# EAGLE design lab4_v1 (EAGLE 6.5.0)
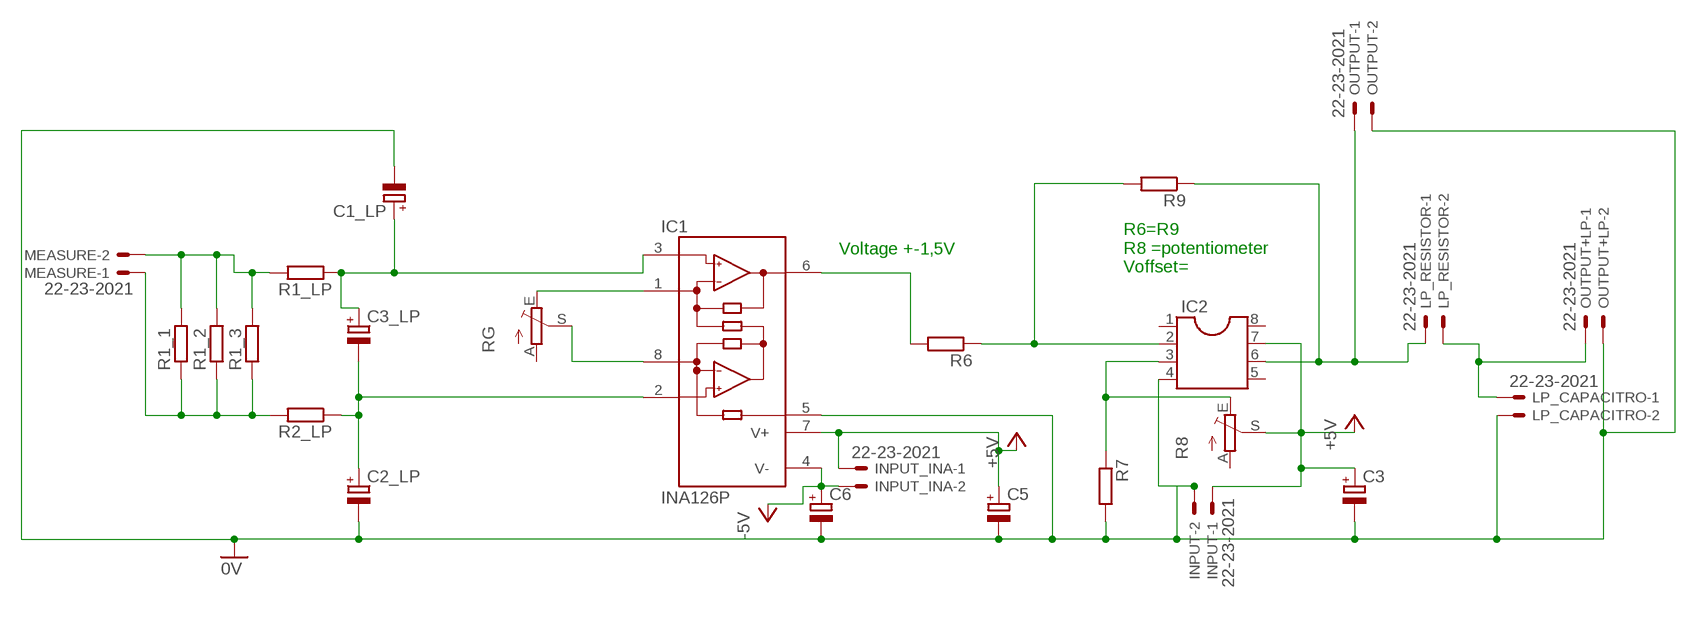
[diagram p0: schematic, sheet 1]

## Parts
C1_LP  CPOL-EUE5-10.5  [E5-10,5]
C2_LP  CPOL-EUE5-10.5  [E5-10,5]
C3  CPOL-EUE5-10.5  [E5-10,5]
C3_LP  CPOL-EUE5-10.5  [E5-10,5]
C5  CPOL-EUE5-10.5  [E5-10,5]
C6  CPOL-EUE5-10.5  [E5-10,5]
IC1  INA126P  [DIL08]
IC2  DIL8  [DIL08]
INPUT  22-23-2021  [22-23-2021]
INPUT_INA  22-23-2021  [22-23-2021]
LP_CAPACITRO  22-23-2021  [22-23-2021]
LP_RESISTOR  22-23-2021  [22-23-2021]
MEASURE  22-23-2021  [22-23-2021]
OUTPUT  22-23-2021  [22-23-2021]
OUTPUT+LP  22-23-2021  [22-23-2021]
R1_1  R-EU_0617/22  [0617/22]
R1_2  R-EU_0617/22  [0617/22]
R1_3  R-EU_0617/22  [0617/22]
R1_LP  R-EU_0207/7  [0207/7]
R2_LP  R-EU_0207/7  [0207/7]
R6  R-EU_0207/7  [0207/7]
R7  R-EU_0207/7  [0207/7]
R8  TRIM_EU-B25P  [B25P]
R9  R-EU_0207/7  [0207/7]
RG  TRIM_EU-B25P  [B25P]

## Nets
+5V_1: C3.+ C5.+ IC1.7(V+) IC2.7 INPUT.1 INPUT_INA.1 R8.S ; supply symbol labelled +5V
-5V: C6.+ IC1.4(V-) INPUT_INA.2
GND: C1_LP.- C2_LP.- C3.- C5.- C6.- IC1.5(REF) IC2.4 INPUT.2 LP_CAPACITRO.2 OUTPUT+LP.2 OUTPUT.2 R7.2 ; supply symbol labelled 0V
N$1: C1_LP.+ C3_LP.+ IC1.3(+IN) R1_LP.1
N$2: C2_LP.+ C3_LP.- IC1.2(-IN) R2_LP.1
N$3: IC1.8(RG) RG.S
N$4: IC1.1(RG) RG.E
N$5: IC1.6(OUT) R6.2
N$6: IC2.2 R6.1 R9.2
N$7: IC2.3 R7.1 R8.E
N$8: MEASURE.1 R1_1.1 R1_2.1 R1_3.1 R2_LP.2
N$9: MEASURE.2 R1_1.2 R1_2.2 R1_3.2 R1_LP.2
N$10: IC2.6 LP_RESISTOR.1 OUTPUT.1 R9.1
N$11: LP_CAPACITRO.1 LP_RESISTOR.2 OUTPUT+LP.1
Unconnected: IC2.1 IC2.5 IC2.8 R8.A RG.A

## Notes on the sheet
- Voltage +-1,5V
- R6=R9
  R8 =potentiometer
  Voffset=

## Library data of the parts
C1_LP C2_LP C3 C3_LP C5 C6 = resistor:CPOL-EU: POLARIZED CAPACITOR, European symbol
IC1 = burr-brown:INA126: Instrumentation Amplifier Micropower, Single and Dual Versions; MF: TEXAS INSTRUMENT CONNECTORS; MPN: INA126P; OC_FARNELL: 1509595; OC_NEWARK: 74C9780
IC2 = ic-package:DIL8: Dual In Line / Socket
INPUT INPUT_INA LP_CAPACITRO LP_RESISTOR MEASURE OUTPUT OUTPUT+LP = con-molex:22-23-2021: .100" (2.54mm) Center Header - 2 Pin; MF: MOLEX; MPN: 22-23-2021; OC_FARNELL: 1462926; OC_NEWARK: 25C3832
R1_1-R1_3 R1_LP R2_LP R6 R7 R9 = resistor:R-EU_: RESISTOR, European symbol
R8 RG = pot:TRIM_EU-: POTENTIOMETER

## Board
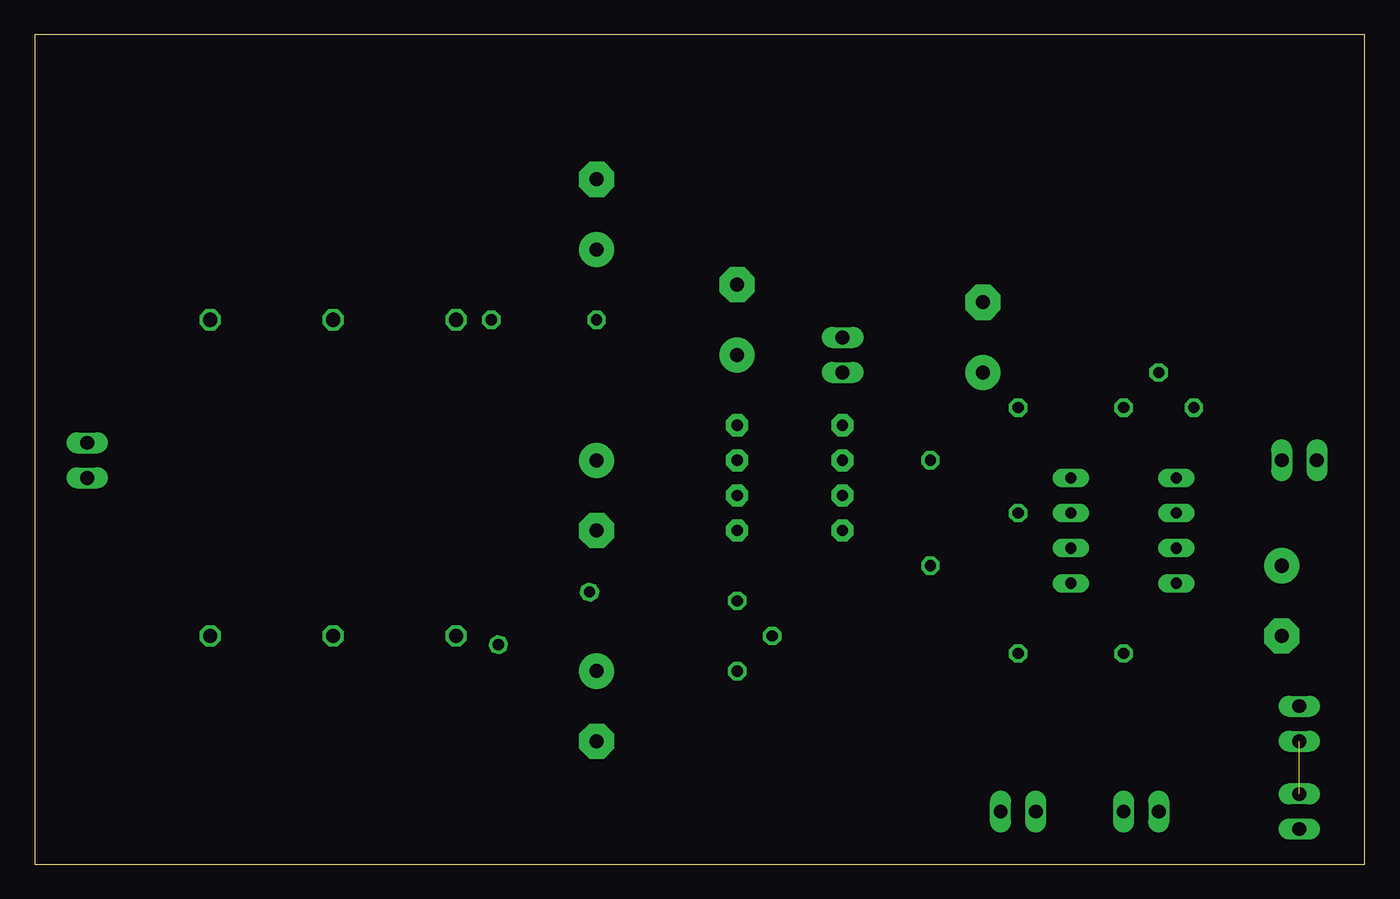
[diagram p1: board, top side]
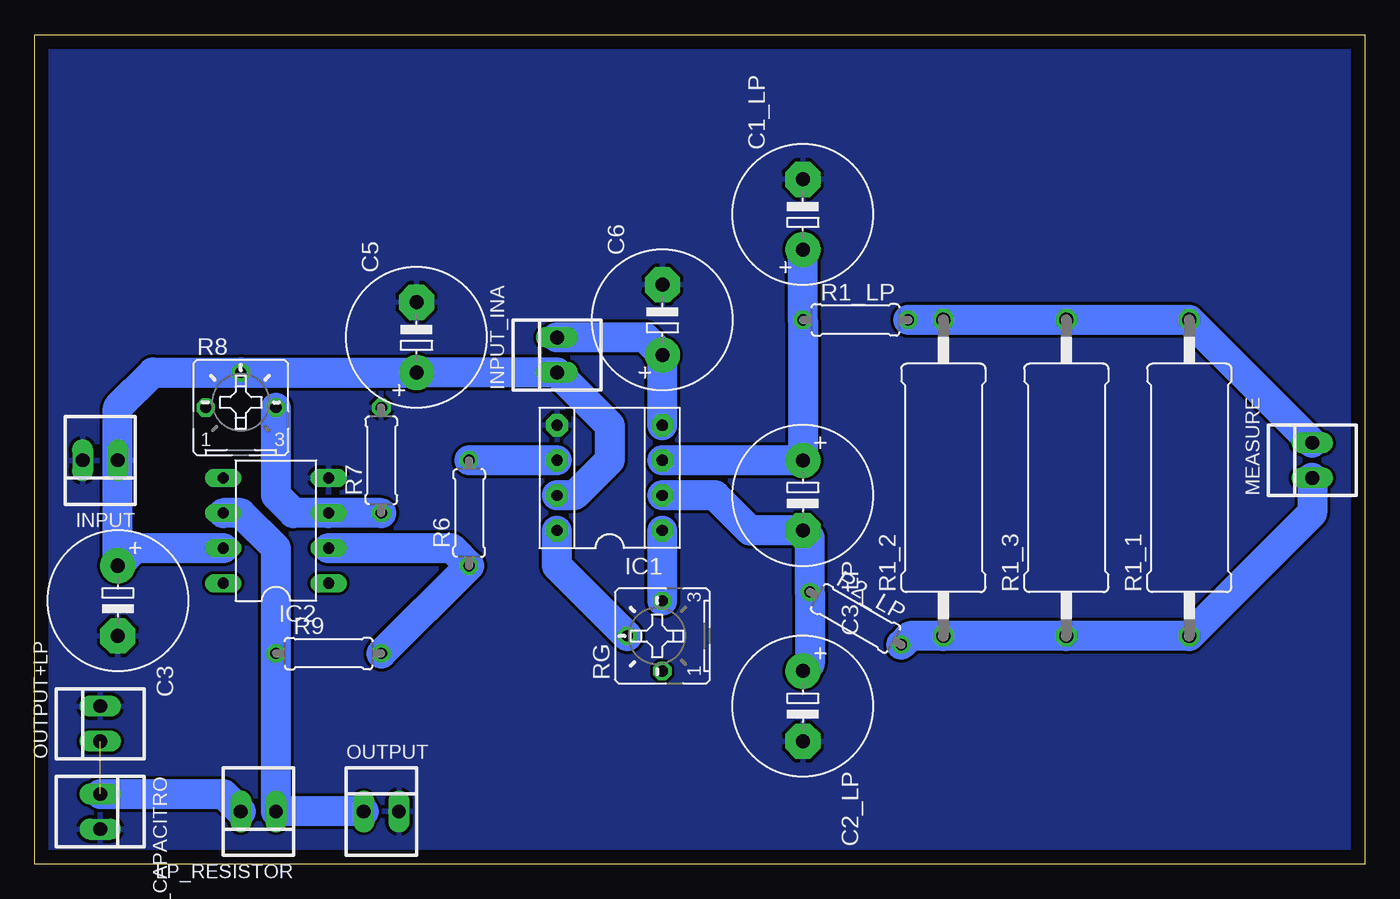
[diagram p2: board, bottom side, seen from below]

Size 96.19 x 60 mm. Coordinates in mm from the lower left corner, seen from the top.
Outline: 0,0 96.19,0 96.19,60 0,60 0,0
Copper layers (1*16): Top 0.035mm / dielectric 1.5mm / Bottom 0.035mm
Design rules "default": minimum track width 10mil, minimum drill 24mil, track to track 8mil, track to pad 8mil, pad to pad 8mil, via to via 8mil, smd to smd 8mil, copper to edge 40mil, drill to drill 8mil, minimum pad ring 10mil, minimum via ring 8mil, stop-mask expansion 4mil, vias tented up to drill 0mil, thermal gap 10mil

### Footprints (pad centres in the part's own frame; a part is rotated, then mirrored left to right if it is on the bottom)
E5-10,5 = drill 1.016 pad 2.54: + -2.54,0 | drill 1.016 pad 2.54 octagon: - 2.54,0
DIL08 = drill 0.813 pad 1.6 octagon: 1 -3.81,-3.81; 2 -1.27,-3.81; 3 1.27,-3.81; 4 3.81,-3.81; 5 3.81,3.81; 6 1.27,3.81; 7 -1.27,3.81; 8 -3.81,3.81
DIL08' = drill 0.813 long: 1 -3.81,-3.81; 2 -1.27,-3.81; 3 1.27,-3.81; 4 3.81,-3.81; 5 3.81,3.81; 6 1.27,3.81; 7 -1.27,3.81; 8 -3.81,3.81
22-23-2021 = drill 1 long: 1 -1.27,0; 2 1.27,0
0617/22 = drill 1.016 octagon: 1 -11.43,0; 2 11.43,0
0207/7 = drill 0.813 octagon: 1 -3.81,0; 2 3.81,0
B25P = drill 0.813 octagon: A -2.54,0; E 2.54,0; S 0,2.54

### Placement (x,y rotation side)
C1_LP  40.64,46.99 90 bottom
C2_LP  40.64,11.43 270 bottom
C3  90.17,19.05 270 bottom
C3_LP  40.64,26.67 270 bottom
C5  68.58,38.1 90 bottom
C6  50.8,39.37 90 bottom
IC1  54.61,27.94 90 bottom
IC2  [DIL08']  78.74,24.13 90 bottom
INPUT  91.44,29.21 180 bottom
INPUT_INA  58.42,36.83 90 bottom
LP_CAPACITRO  91.44,3.81 270 bottom
LP_RESISTOR  80.01,3.81 180 bottom
MEASURE  3.81,29.21 90 bottom
OUTPUT  71.12,3.81 0 bottom
OUTPUT+LP  91.44,10.16 90 bottom
R1_1  12.7,27.94 90 bottom
R1_2  30.48,27.94 90 bottom
R1_3  21.59,27.94 90 bottom
R1_LP  36.83,39.37 0 bottom
R2_LP  36.83,17.78 330 bottom
R6  64.77,25.4 90 bottom
R7  71.12,29.21 90 bottom
R8  81.28,33.02 0 bottom
R9  74.93,15.24 0 bottom
RG  50.8,16.51 90 bottom

### Tracks (layer width: path | path; a pad name or v marks a point on that pad's centre or on a via)
+5V_1
  Bottom 2.184: IC1.7 57.15,26.67 54.61,29.21 54.61,31.75 INPUT_INA.1 C5.+ R8.S 87.63,35.56 90.17,33.02 INPUT.1 C3.+ 88.9,22.86 IC2.7
-5V
  Bottom 2.184: IC1.4 C6.+ 52.07,38.1 INPUT_INA.2
GND
  pour Bottom: -1.27,60.96 -1.27,-1.27 97.79,-1.27 97.79,60.96
N$1
  Bottom 2.184: IC1.3 C3_LP.+ R1_LP.1 C1_LP.+
N$2
  Bottom 2.184: IC1.2 46.99,26.67 44.45,24.13 C3_LP.- 40.13,23.62 R2_LP.1 40.13,14.48 C2_LP.+
N$3
  Bottom 2.184: RG.S 58.42,21.59 IC1.8
N$4
  Bottom 2.184: RG.E IC1.1
N$5
  Bottom 2.184: IC1.6 R6.2
N$6
  Bottom 2.184: R9.2 R6.1 66.04,22.86 IC2.2
N$7
  Bottom 2.184: R8.E 78.74,26.67 77.47,25.4 IC2.3 R7.1
N$8
  Bottom 2.184: MEASURE.1 3.81,25.4 R1_1.1 R1_3.1 R1_2.1 32.9,16.51 R2_LP.2
N$9
  Bottom 2.184: MEASURE.2 R1_1.2 R1_3.2 R1_2.2 R1_LP.2
N$10
  Bottom 2.184: IC2.6 81.28,25.4 78.74,22.86 R9.1 LP_RESISTOR.1 OUTPUT.1
N$11  (1 unrouted)
  Bottom 2.184: LP_CAPACITRO.1 82.55,5.08 LP_RESISTOR.2